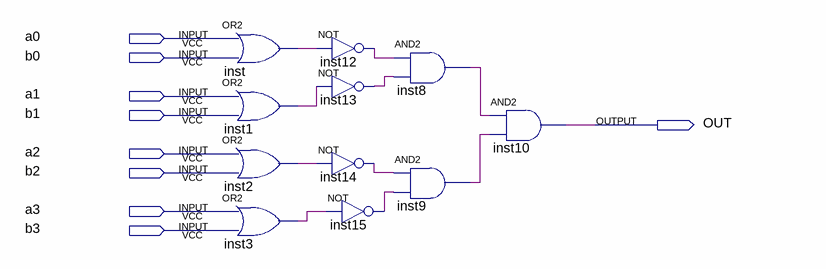
[diagram p0: schematic sheet]
// Quartus schematic zero.bdf as structural Verilog: 11 symbols, 9 pins
module zero (
  input  a0,
  input  b0,
  input  a1,
  input  b1,
  input  a2,
  input  b2,
  input  a3,
  input  b3,
  output OUT
);

  wire inst1_out, inst2_out, inst3_out, inst8_out, inst9_out, inst12_out, inst13_out, inst14_out, inst15_out,
       inst_out;

  or inst (inst_out, a0, b0);
  or inst1 (inst1_out, a1, b1);
  or inst2 (inst2_out, a2, b2);
  or inst3 (inst3_out, a3, b3);
  not inst12 (inst12_out, inst_out);
  not inst13 (inst13_out, inst1_out);
  not inst14 (inst14_out, inst2_out);
  not inst15 (inst15_out, inst3_out);
  and inst8 (inst8_out, inst12_out, inst13_out);
  and inst9 (inst9_out, inst14_out, inst15_out);
  and inst10 (OUT, inst8_out, inst9_out);
endmodule
